# Altium project B302.PrjPcb (part 1 of 2)
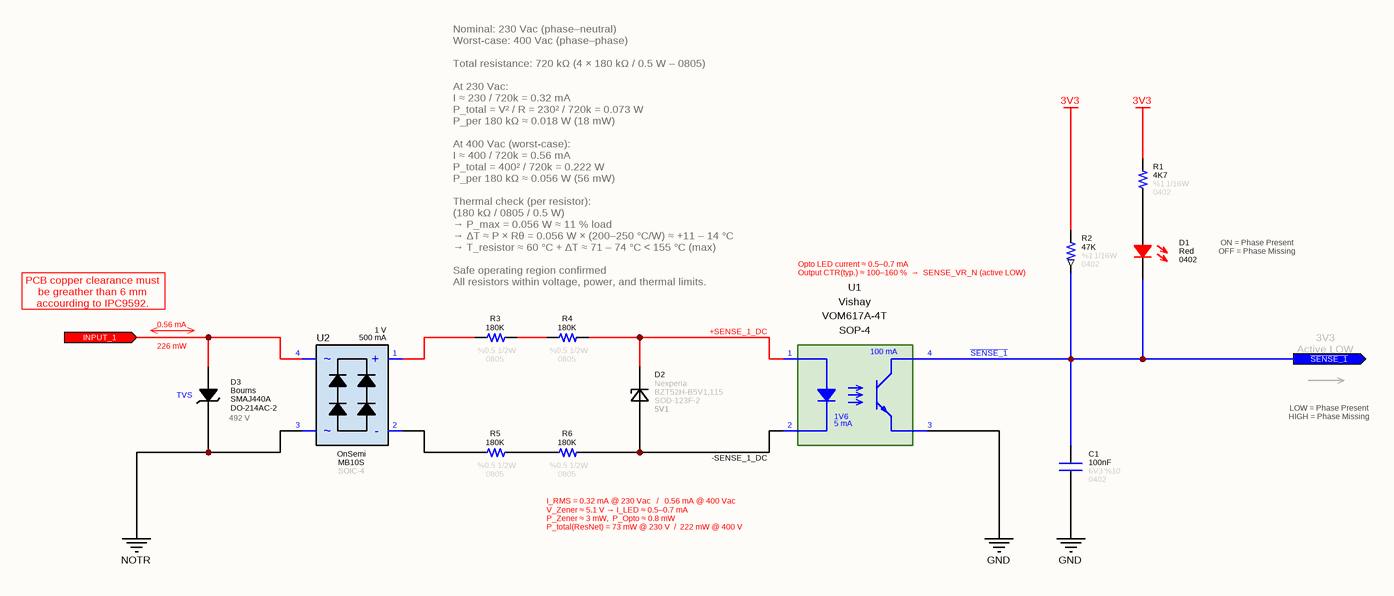
[diagram p0: Sense 1 Signal Isolation.SchDoc]
Address1_: Seker Mah. Ayyildiz Sok.; Address2_: Silverstar Apt. 7/7; Address3_: Selcuklu / Konya; Address4_: Türkiye; Copyright_: Copyright 2026 Gunce Akkoyun (Commercial Secret); Customer_: -; Engineer_: Gunce Akkoyun; Git_Repo_Address_: www.github.com/akkoyun/B302; Module_ID_: B302; Organization_: -; Product_Desc_: 220V to TTL Input Module; Product_ID_: B302; Revision_: DA; Version_: 00.00.01
11 sheets, 98 parts. Net scope: hierarchical (ports join the sheet entries above them; power ports are global).
Board file: B302.PcbDoc
Sheets:
  Sense 1 Signal Isolation.SchDoc
  Block Diagram.SchDoc
    Card Edge Connector = Card Edge Connector.SchDoc
  Sense 2 Signal Isolation.SchDoc
  Sense 3 Signal Isolation.SchDoc
  Sense 4 Signal Isolation.SchDoc
  Sense 5 Signal Isolation.SchDoc
  Sense 6 Signal Isolation.SchDoc
  Sense 7 Signal Isolation.SchDoc
  Sense 8 Signal Isolation.SchDoc
  Input Connector.SchDoc

## Sheet Sense 1 Signal Isolation.SchDoc: Signal 1 Isolator
size 292 x 193 mm; SheetNumber: 3; SheetTotal: 11

### Parts
C1  value 100nF  Tolerance: %10  Voltage: 6V3  Case: 0402  [CAPACITOR_0402]  (hidden comment: Capacitor - 100nF [0402] (MLCC))
D1  Case: 0402  Color: Red  [LED_0402]  (hidden comment: SMD LED (Red))
D2  Zener Voltage: 5V1  Manufacturer Name: Nexperia  [SOD-123F-2]  (hidden comment: BZT52H-B5V1,115)
D3  BreakDown Voltage: 492 V  Manufacturer Name: Bourns  Case: DO-214AC-2  [DO-220AA-2]  (hidden comment: SMAJ440A)
R1  value 4K7  Tolerance: %1  Case: 0402  Power: 1/16W  [RESISTOR_0402]  (hidden comment: 4K7 - 0402 - %1 - 1/16W)
R2  value 47K  Tolerance: %1  Case: 0402  Power: 1/16W  [RESISTOR_0402]  (hidden comment: 47K - 0402 - %1 - 1/16W)
R3  value 180K  Tolerance: %0.5  Case: 0805  Power: 1/2W  [RESISTOR_0805]  (hidden comment: 180K - 0805 - %0.5 - 1/2W)
R4  value 180K  Tolerance: %0.5  Case: 0805  Power: 1/2W  [RESISTOR_0805]  (hidden comment: 180K - 0805 - %0.5 - 1/2W)
R5  value 180K  Tolerance: %0.5  Case: 0805  Power: 1/2W  [RESISTOR_0805]  (hidden comment: 180K - 0805 - %0.5 - 1/2W)
R6  value 180K  Tolerance: %0.5  Case: 0805  Power: 1/2W  [RESISTOR_0805]  (hidden comment: 180K - 0805 - %0.5 - 1/2W)
U1  Manufacturer Name: Vishay  Case: SOP-4  If - Forward Current: 5 mA  Vf - Forward Voltage: 1V6  Maximum Collector Current: 100 mA  [SOP-4V2]  (hidden comment: VOM617A-4T)
U2  If - Forward Current: 500 mA  Vf - Forward Voltage: 1 V  Manufacturer Name: OnSemi  Manufacturer Part Number: MB10S  [SOIC-4]  (hidden comment: LTV-846S)

### Ports
INPUT_1 (in), ~{SENSE_1} (out)

### Nets
3V3: R1.2 R2.2
GND: C1.1 U1.3(Emiter)
NOTR: D3.2(Cathode) U2.3
+SENSE_1_DC: D2.1(Cathode) R4.1 U1.1(LED_Anode)
-SENSE_1_DC: D2.2(Anode) R6.1 U1.2(LED_Cathode)
~{SENSE_1}: C1.2 D1.1 R2.1 U1.4(Collector) ; port ~{SENSE_1}
NetD1_2: D1.2 R1.1
NetD3_1: D3.1(Anode) U2.4 ; port INPUT_1
NetR3_1: R3.1 R4.2
NetR3_2: R3.2 U2.1(+)
NetR5_1: R5.1 R6.2
NetR5_2: R5.2 U2.2(-)

### Notes on the sheet
- (near R2) Opto LED current ≈ 0.5–0.7 mA
  Output CTR(typ.) ≈ 100–160 %  →  SENSE_VR_N (active LOW)
- ON = Phase Present
  OFF = Phase Missing
- PCB copper clearance must be greather than 6 mm accourding to IPC9592.
- 0.56 mA
- (near D3) 226 mW
- Nominal: 230 Vac (phase–neutral)
  Worst-case: 400 Vac (phase–phase)
  Total resistance: 720 kΩ (4 × 180 kΩ / 0.5 W – 0805)
  At 230 Vac:
  I ≈ 230 / 720k = 0.32 mA
  P_total = V² / R = 230² / 720k = 0.073 W
  P_per 180 kΩ ≈ 0.018 W (18 mW)
  At 400 Vac (worst-case):
  I ≈ 400 / 720k = 0.56 mA
  P_total = 400² / 720k = 0.222 W
  P_per 180 kΩ ≈ 0.056 W (56 mW)
  Thermal check (per resistor):
  (180 kΩ / 0805 / 0.5 W)
  → P_max = 0.056 W ≈ 11 % load
  → ΔT ≈ P × Rθ = 0.056 W × (200–250 °C/W) ≈ +11 – 14 °C
  → T_resistor ≈ 60 °C + ΔT ≈ 71 – 74 °C < 155 °C (max)
  Safe operating region confirmed
  All resistors within voltage, power, and thermal limits.
- 3V3
  Active LOW
- LOW = Phase Present
  HIGH = Phase Missing
- I_RMS = 0.32 mA @ 230 Vac   /   0.56 mA @ 400 Vac
  V_Zener ≈ 5.1 V → I_LED ≈ 0.5–0.7 mA
  P_Zener ≈ 3 mW,  P_Opto ≈ 0.8 mW
  P_total(ResNet) = 73 mW @ 230 V  /  222 mW @ 400 V
- © 2021 All rights reserved.
  This document may not, in whole or in part, be copied, photocopied, reproduced, translated or converted to any electronic or machine readable from without prior written permission of Mehmet Günce Akkoyun.
  Engineer contact : akkoyun@me.com
- Property of
- Engineer :
- Date :
- Size :
- A4
- Time :
- Project :
- Page :
- /
- Customer :
- Product ID :
- Module ID :
- Version :
- File :
- Revision :
- (in symbol Diode - SMAJ440A (TVS)) TVS

### Library data of the parts
C1 = Capacitor - 100nF [0402-6V3]: Capacitor (MLCC) - 100nF / 6V3 / 0402; Manufacturer Name: KYOCERA AVX; Manufacturer Part Number: 04026D104KAT4A; ComponentLink1Description: Mouser; ComponentLink1URL: https://www.mouser.com.tr/ProductDetail/AVX/04026D104KAT4A?qs=sGAEpiMZZMs0AnBnWHyRQPg4iYkCw7IMED%2F4kpqgf7w%3D; ComponentLink2Description: DataSheet; ComponentLink2URL: https://www.mouser.com.tr/datasheet/2/40/cx5r-776519.pdf; Subcategory: Capacitors
D1 = Diode - LED (0402-Red): Standard LEDs - SMD MINI-MOLD ULTRA COMPACT RED; Manufacturer Name: ROHM Semiconductor; Manufacturer Part Number: SML-P12VTT86R; ROHS: Yes; ComponentLink1Description: DataSheet; ComponentLink1URL: https://www.mouser.com.tr/datasheet/2/348/sml-p1-e-1139198.pdf; ComponentLink2Description: Mouser; ComponentLink2URL: https://www.mouser.com.tr/ProductDetail/ROHM-Semiconductor/SML-P12U2TT86R?qs=sGAEpiMZZMseGfSY3csMkRIBDsfU3UCXJTULB5gem9Ta%252Bp%252BvZ709fg%3D%3D
D2 = Diode - BZT52H-B5V1,115: Zener Diodes BZT52H-B5V1/SOD123F/SOD2; Product Type: Zener Diodes; RoHS: Yes; Manufacturer Part Number: BZT52H-B5V1,115; Case: SOD-123F-2
D3 = Diode - SMAJ440A (TVS): ESD Protection Diodes / TVS Diodes 440volts 1uA .6 Amps Uni-Dir; Peak Pulse Current: 600 mA; Working Voltage: 440 V; Clamping Voltage: 713 V; Product Type: TVS Diodes; RoHS: Yes; Manufacturer Part Number: SMAJ440A
R1 = Resistor - 4K7 [0402]: Thick Film Resistors - SMD 1/16 W 4.7 KOhm 1%; Manufacturer Name: Vishay; Manufacturer Part Number: CRCW04024K70FKED; ComponentLink1Description: DataSheet; ComponentLink1URL: https://www.mouser.com.tr/datasheet/2/427/dcrcwe3-1762152.pdf; ComponentLink2Description: Mouser; ComponentLink2URL: https://www.mouser.com.tr/ProductDetail/Vishay-Dale/CRCW04024K70FKED?qs=sGAEpiMZZMu61qfTUdNhG7nHf%2F6MTUn3HadIdDQu24Q%3D
R2 = Resistor - 47K [0402]: Thick Film Resistors - SMD 1/16 W 47 KOhm 1%; Manufacturer Name: Vishay; Manufacturer Part Number: CRCW040247K0FKED; ComponentLink1Description: DataSheet; ComponentLink1URL: https://www.mouser.com.tr/datasheet/2/427/dcrcwe3-1762152.pdf; ComponentLink2Description: Mouser; ComponentLink2URL: https://www.mouser.com.tr/ProductDetail/Vishay-Dale/CRCW040247K0FKED?qs=sGAEpiMZZMu61qfTUdNhG2DpbjADlD3GL%252B3h1elTxqU%3D
R3-R6 = Resistor - 180K [0805]: Thick Film Resistors - SMD 0805 180Kohms 0.5W 0.5% AEC-Q200; Manufacturer Name: Panasonic; Manufacturer Part Number: ERJ-P06D1803V; ComponentLink1Description: DataSheet; ComponentLink1URL: https://www.mouser.com.tr/datasheet/2/427/dcrcwe3-1762152.pdf; ComponentLink2Description: Mouser; ComponentLink2URL: https://www.mouser.com.tr/ProductDetail/Vishay-Dale/CRCW040210K0FKED?qs=sGAEpiMZZMu61qfTUdNhG2DpbjADlD3GcalbOv9utCY%3D
U1 = IC - VOM617A: Transistor Output Optocouplers Phototransistor Out CTR 160-320% 5mA; RoHS: Yes; Product Type: Transistor Output Optocouplers; Manufacturer Part Number: VOM617A-4T
U2 = IC - MB10S: Transistor Output Optocouplers Optocplr Phototrans 4-Channel; Case: SOIC-4

## Sheet Block Diagram.SchDoc: B302AA Block Diagram
size 292 x 193 mm; SheetNumber: 1; SheetTotal: 11
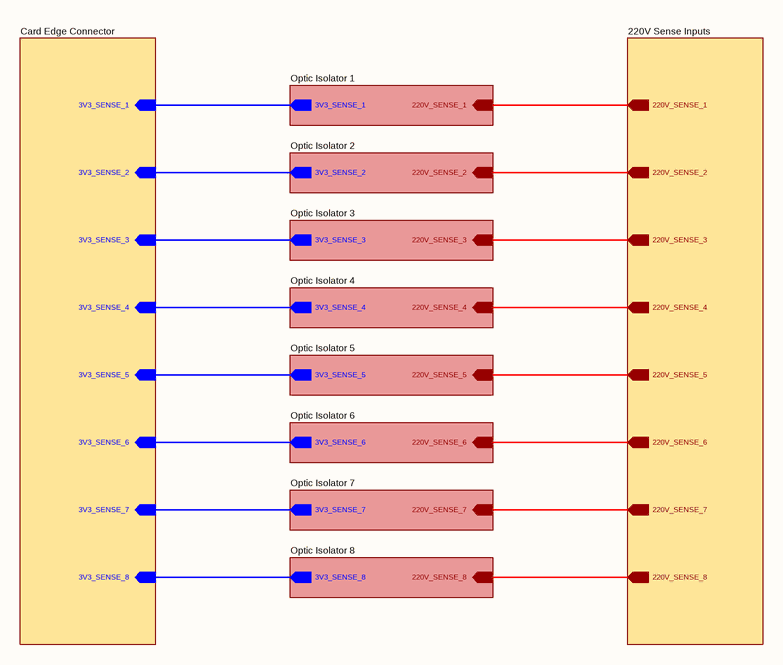
[diagram p1: Block Diagram.SchDoc]

### Sub-sheets
220V Sense Inputs = 220V Sense Input Socket.SchDoc (file not in this document): 220V_SENSE_2 (out), 220V_SENSE_1 (out), 220V_SENSE_5 (out), 220V_SENSE_6 (out), 220V_SENSE_3 (out), 220V_SENSE_4 (out), 220V_SENSE_7 (out), 220V_SENSE_8 (out)
Card Edge Connector = Card Edge Connector.SchDoc: 3V3_SENSE_1 (in), 3V3_SENSE_2 (in), 3V3_SENSE_3 (in), 3V3_SENSE_4 (in), 3V3_SENSE_5 (in), 3V3_SENSE_6 (in), 3V3_SENSE_8 (in), 3V3_SENSE_7 (in)
Optic Isolator 1 = Opto Isolator 1.SchDoc (file not in this document): 220V_SENSE_1 (in), 3V3_SENSE_1 (out)
Optic Isolator 2 = Opto Isolator 2.SchDoc (file not in this document): 220V_SENSE_2 (in), 3V3_SENSE_2 (out)
Optic Isolator 3 = Opto Isolator 3.SchDoc (file not in this document): 220V_SENSE_3 (in), 3V3_SENSE_3 (out)
Optic Isolator 4 = Opto Isolator 4.SchDoc (file not in this document): 220V_SENSE_4 (in), 3V3_SENSE_4 (out)
Optic Isolator 5 = Opto Isolator 5.SchDoc (file not in this document): 220V_SENSE_5 (in), 3V3_SENSE_5 (out)
Optic Isolator 6 = Opto Isolator 6.SchDoc (file not in this document): 220V_SENSE_6 (in), 3V3_SENSE_6 (out)
Optic Isolator 7 = Opto Isolator 7.SchDoc (file not in this document): 220V_SENSE_7 (in), 3V3_SENSE_7 (out)
Optic Isolator 8 = Opto Isolator 8.SchDoc (file not in this document): 220V_SENSE_8 (in), 3V3_SENSE_8 (out)

### Nets
(unnamed): sheet 220V Sense Inputs/220V_SENSE_2, sheet Optic Isolator 2/220V_SENSE_2
(unnamed): sheet 220V Sense Inputs/220V_SENSE_1, sheet Optic Isolator 1/220V_SENSE_1
(unnamed): sheet 220V Sense Inputs/220V_SENSE_5, sheet Optic Isolator 5/220V_SENSE_5
(unnamed): sheet 220V Sense Inputs/220V_SENSE_6, sheet Optic Isolator 6/220V_SENSE_6
(unnamed): sheet 220V Sense Inputs/220V_SENSE_3, sheet Optic Isolator 3/220V_SENSE_3
(unnamed): sheet 220V Sense Inputs/220V_SENSE_4, sheet Optic Isolator 4/220V_SENSE_4
(unnamed): sheet 220V Sense Inputs/220V_SENSE_7, sheet Optic Isolator 7/220V_SENSE_7
(unnamed): sheet 220V Sense Inputs/220V_SENSE_8, sheet Optic Isolator 8/220V_SENSE_8
(unnamed): sheet Optic Isolator 1/3V3_SENSE_1, sheet Card Edge Connector/3V3_SENSE_1
(unnamed): sheet Card Edge Connector/3V3_SENSE_2, sheet Optic Isolator 2/3V3_SENSE_2
(unnamed): sheet Card Edge Connector/3V3_SENSE_3, sheet Optic Isolator 3/3V3_SENSE_3
(unnamed): sheet Card Edge Connector/3V3_SENSE_4, sheet Optic Isolator 4/3V3_SENSE_4
(unnamed): sheet Card Edge Connector/3V3_SENSE_5, sheet Optic Isolator 5/3V3_SENSE_5
(unnamed): sheet Card Edge Connector/3V3_SENSE_6, sheet Optic Isolator 6/3V3_SENSE_6
(unnamed): sheet Card Edge Connector/3V3_SENSE_8, sheet Optic Isolator 8/3V3_SENSE_8
(unnamed): sheet Card Edge Connector/3V3_SENSE_7, sheet Optic Isolator 7/3V3_SENSE_7

### Notes on the sheet
- © 2021 All rights reserved.
  This document may not, in whole or in part, be copied, photocopied, reproduced, translated or converted to any electronic or machine readable from without prior written permission of Mehmet Günce Akkoyun.
  Engineer contact : akkoyun@me.com
- Property of
- Engineer :
- Date :
- Size :
- A4
- Time :
- Project :
- Page :
- /
- Customer :
- Product ID :
- Module ID :
- Version :
- File :
- Revision :

## Sheet Card Edge Connector.SchDoc: Card Edge Connector
size 292 x 193 mm; SheetNumber: 2; SheetTotal: 11
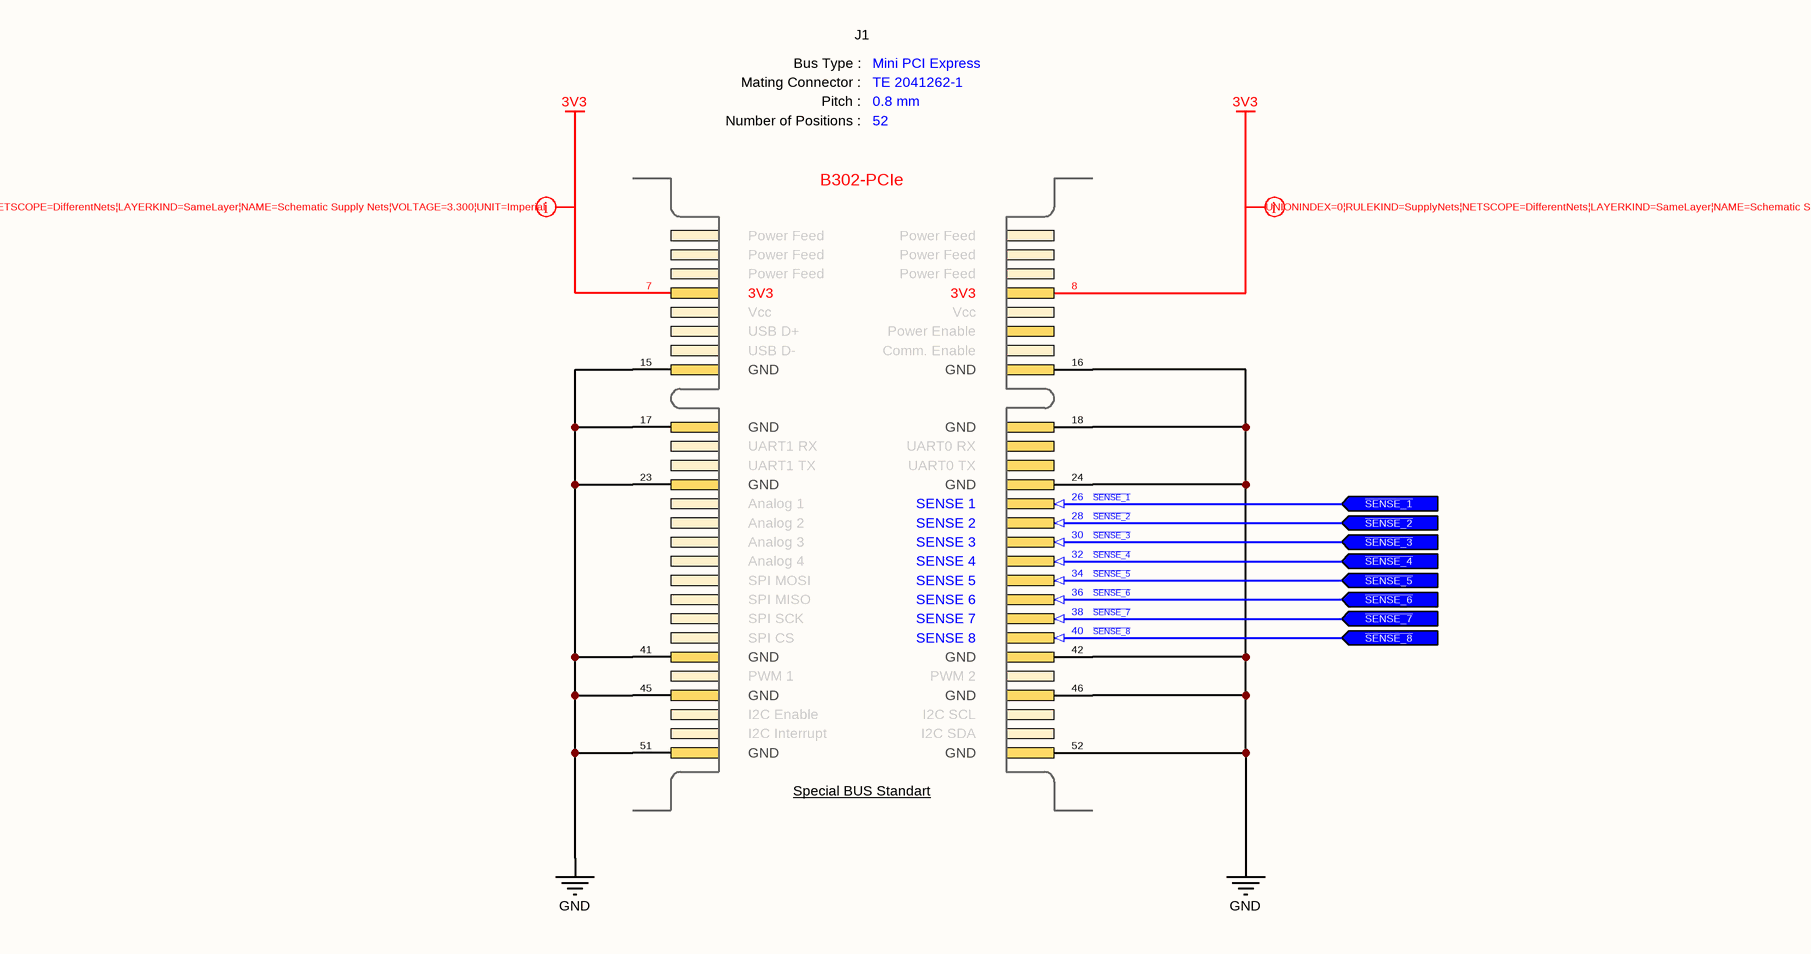
[diagram p2: Card Edge Connector.SchDoc]

### Parts
J1  BUS Type: Mini PCI Express  Mating Connector: TE 2041262-1  Pitch: 0.8 mm  Number of Positions: 52  [PCB - Mini PCI Express]  (hidden comment: Connector - Mini PCI-E (Male B302-PCIe))  (no BOM)

### Ports
~{SENSE_1} (in), ~{SENSE_2} (in), ~{SENSE_3} (in), ~{SENSE_4} (in), ~{SENSE_5} (in), ~{SENSE_6} (in), ~{SENSE_7} (in), ~{SENSE_8} (in)

### Nets
3V3: J1.7(Pin-7) J1.8(Pin-8)
GND: J1.15(Pin-15) J1.16(Pin-16) J1.17(Pin-17) J1.18(Pin-18) J1.23(Pin-23) J1.24(Pin-24) J1.41(Pin-41) J1.42(Pin-42) J1.45(Pin-45) J1.46(Pin-46) J1.51(Pin-51) J1.52(Pin-52)
~{SENSE_1}: J1.26(Pin-26) ; port ~{SENSE_1}
~{SENSE_2}: J1.28(Pin-28) ; port ~{SENSE_2}
~{SENSE_3}: J1.30(Pin-30) ; port ~{SENSE_3}
~{SENSE_4}: J1.32(Pin-32) ; port ~{SENSE_4}
~{SENSE_5}: J1.34(Pin-34) ; port ~{SENSE_5}
~{SENSE_6}: J1.36(Pin-36) ; port ~{SENSE_6}
~{SENSE_7}: J1.38(Pin-38) ; port ~{SENSE_7}
~{SENSE_8}: J1.40(Pin-40) ; port ~{SENSE_8}

### Layout directives
rule Supply Nets [Voltage = 3.300]: 3V3

### Notes on the sheet
- © 2021 All rights reserved.
  This document may not, in whole or in part, be copied, photocopied, reproduced, translated or converted to any electronic or machine readable from without prior written permission of Mehmet Günce Akkoyun.
  Engineer contact : akkoyun@me.com
- Property of
- Engineer :
- Date :
- Size :
- A4
- Time :
- Project :
- Page :
- /
- Customer :
- Product ID :
- Module ID :
- Version :
- File :
- Revision :
- (in symbol Connector - Mini PCI-E (Male B302-PCIe)) Bus Type :; Mating Connector :; Pitch :; Number of Positions :; B302-PCIe; Power Feed; 3V3; Vcc; USB D+; Power Enable; USB D-; Comm. Enable; GND; UART1 RX; UART0 RX; UART1 TX; UART0 TX; Analog 1; SENSE 1; Analog 2; SENSE 2; Analog 3; SENSE 3; Analog 4; SENSE 4; SPI MOSI; SENSE 5; SPI MISO; SENSE 6; SPI SCK; SENSE 7; SPI CS; SENSE 8; PWM 1; PWM 2; I2C Enable; I2C SCL; I2C Interrupt; I2C SDA; Special BUS Standart

### Library data of the parts
J1 = Connector - Mini PCI-E (Male B302-PCIe): Mini PCI-Express gold finger connector.; System: Connector

## Sheet Sense 2 Signal Isolation.SchDoc: Signal 2 Isolator
size 292 x 193 mm; SheetNumber: 4; SheetTotal: 11
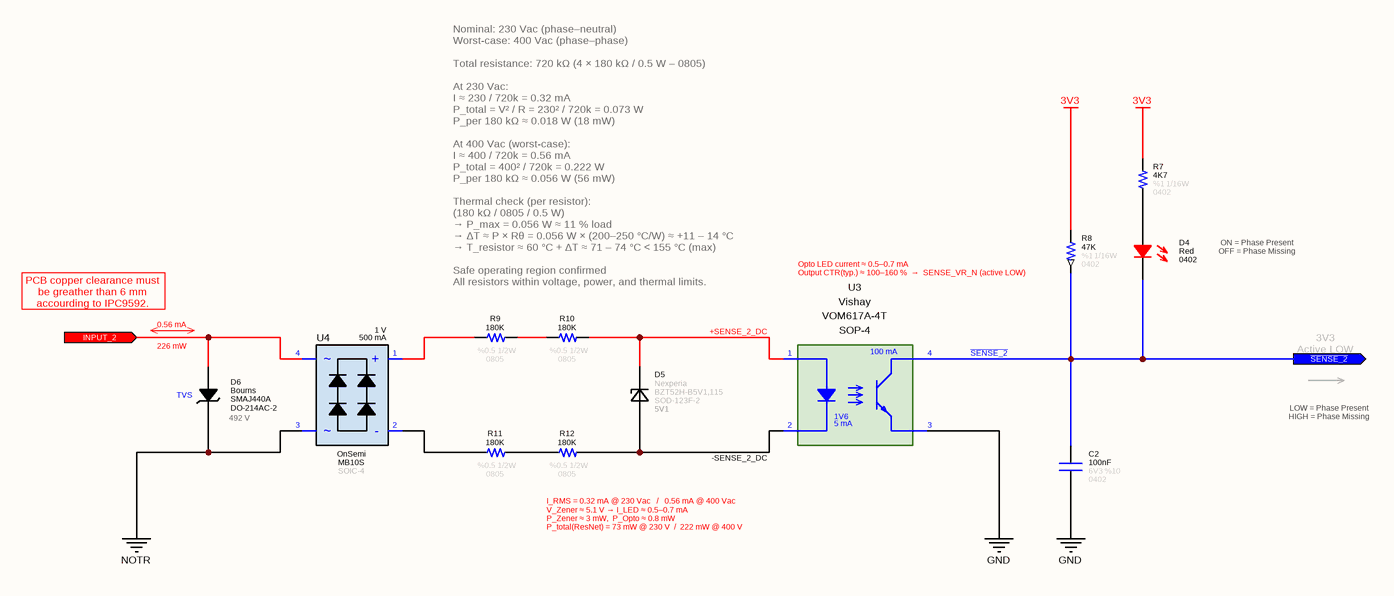
[diagram p3: Sense 2 Signal Isolation.SchDoc]

### Parts
C2  value 100nF  Tolerance: %10  Voltage: 6V3  Case: 0402  [CAPACITOR_0402]  (hidden comment: Capacitor - 100nF [0402] (MLCC))
D4  Case: 0402  Color: Red  [LED_0402]  (hidden comment: SMD LED (Red))
D5  Zener Voltage: 5V1  Manufacturer Name: Nexperia  [SOD-123F-2]  (hidden comment: BZT52H-B5V1,115)
D6  BreakDown Voltage: 492 V  Manufacturer Name: Bourns  Case: DO-214AC-2  [DO-220AA-2]  (hidden comment: SMAJ440A)
R7  value 4K7  Tolerance: %1  Case: 0402  Power: 1/16W  [RESISTOR_0402]  (hidden comment: 4K7 - 0402 - %1 - 1/16W)
R8  value 47K  Tolerance: %1  Case: 0402  Power: 1/16W  [RESISTOR_0402]  (hidden comment: 47K - 0402 - %1 - 1/16W)
R9  value 180K  Tolerance: %0.5  Case: 0805  Power: 1/2W  [RESISTOR_0805]  (hidden comment: 180K - 0805 - %0.5 - 1/2W)
R10  value 180K  Tolerance: %0.5  Case: 0805  Power: 1/2W  [RESISTOR_0805]  (hidden comment: 180K - 0805 - %0.5 - 1/2W)
R11  value 180K  Tolerance: %0.5  Case: 0805  Power: 1/2W  [RESISTOR_0805]  (hidden comment: 180K - 0805 - %0.5 - 1/2W)
R12  value 180K  Tolerance: %0.5  Case: 0805  Power: 1/2W  [RESISTOR_0805]  (hidden comment: 180K - 0805 - %0.5 - 1/2W)
U3  Manufacturer Name: Vishay  Case: SOP-4  If - Forward Current: 5 mA  Vf - Forward Voltage: 1V6  Maximum Collector Current: 100 mA  [SOP-4V2]  (hidden comment: VOM617A-4T)
U4  If - Forward Current: 500 mA  Vf - Forward Voltage: 1 V  Manufacturer Name: OnSemi  Manufacturer Part Number: MB10S  [SOIC-4]  (hidden comment: LTV-846S)

### Ports
INPUT_2 (in), ~{SENSE_2} (out)

### Nets
3V3: R7.2 R8.2
GND: C2.1 U3.3(Emiter)
NOTR: D6.2(Cathode) U4.3
+SENSE_2_DC: D5.1(Cathode) R10.1 U3.1(LED_Anode)
-SENSE_2_DC: D5.2(Anode) R12.1 U3.2(LED_Cathode)
~{SENSE_2}: C2.2 D4.1 R8.1 U3.4(Collector) ; port ~{SENSE_2}
NetD4_2: D4.2 R7.1
NetD6_1: D6.1(Anode) U4.4 ; port INPUT_2
NetR9_1: R9.1 R10.2
NetR9_2: R9.2 U4.1(+)
NetR11_1: R11.1 R12.2
NetR11_2: R11.2 U4.2(-)

### Notes on the sheet
- (near R8) Opto LED current ≈ 0.5–0.7 mA
  Output CTR(typ.) ≈ 100–160 %  →  SENSE_VR_N (active LOW)
- ON = Phase Present
  OFF = Phase Missing
- PCB copper clearance must be greather than 6 mm accourding to IPC9592.
- 0.56 mA
- (near D6) 226 mW
- Nominal: 230 Vac (phase–neutral)
  Worst-case: 400 Vac (phase–phase)
  Total resistance: 720 kΩ (4 × 180 kΩ / 0.5 W – 0805)
  At 230 Vac:
  I ≈ 230 / 720k = 0.32 mA
  P_total = V² / R = 230² / 720k = 0.073 W
  P_per 180 kΩ ≈ 0.018 W (18 mW)
  At 400 Vac (worst-case):
  I ≈ 400 / 720k = 0.56 mA
  P_total = 400² / 720k = 0.222 W
  P_per 180 kΩ ≈ 0.056 W (56 mW)
  Thermal check (per resistor):
  (180 kΩ / 0805 / 0.5 W)
  → P_max = 0.056 W ≈ 11 % load
  → ΔT ≈ P × Rθ = 0.056 W × (200–250 °C/W) ≈ +11 – 14 °C
  → T_resistor ≈ 60 °C + ΔT ≈ 71 – 74 °C < 155 °C (max)
  Safe operating region confirmed
  All resistors within voltage, power, and thermal limits.
- 3V3
  Active LOW
- LOW = Phase Present
  HIGH = Phase Missing
- I_RMS = 0.32 mA @ 230 Vac   /   0.56 mA @ 400 Vac
  V_Zener ≈ 5.1 V → I_LED ≈ 0.5–0.7 mA
  P_Zener ≈ 3 mW,  P_Opto ≈ 0.8 mW
  P_total(ResNet) = 73 mW @ 230 V  /  222 mW @ 400 V
- © 2021 All rights reserved.
  This document may not, in whole or in part, be copied, photocopied, reproduced, translated or converted to any electronic or machine readable from without prior written permission of Mehmet Günce Akkoyun.
  Engineer contact : akkoyun@me.com
- Property of
- Engineer :
- Date :
- Size :
- A4
- Time :
- Project :
- Page :
- /
- Customer :
- Product ID :
- Module ID :
- Version :
- File :
- Revision :
- (in symbol Diode - SMAJ440A (TVS)) TVS

### Library data of the parts
C2 = Capacitor - 100nF [0402-6V3]: as C1 on sheet Sense 1 Signal Isolation; ComponentLink1Description: Mouser; ComponentLink1URL: https://www.mouser.com.tr/ProductDetail/AVX/04026D104KAT4A?qs=sGAEpiMZZMs0AnBnWHyRQPg4iYkCw7IMED%2F4kpqgf7w%3D; ComponentLink2Description: DataSheet; ComponentLink2URL: https://www.mouser.com.tr/datasheet/2/40/cx5r-776519.pdf; Subcategory: Capacitors
D4 = Diode - LED (0402-Red): as D1 on sheet Sense 1 Signal Isolation; ROHS: Yes; ComponentLink1Description: DataSheet; ComponentLink1URL: https://www.mouser.com.tr/datasheet/2/348/sml-p1-e-1139198.pdf; ComponentLink2Description: Mouser; ComponentLink2URL: https://www.mouser.com.tr/ProductDetail/ROHM-Semiconductor/SML-P12U2TT86R?qs=sGAEpiMZZMseGfSY3csMkRIBDsfU3UCXJTULB5gem9Ta%252Bp%252BvZ709fg%3D%3D
D5 = Diode - BZT52H-B5V1,115: Zener Diodes BZT52H-B5V1/SOD123F/SOD2; Product Type: Zener Diodes; RoHS: Yes; Manufacturer Part Number: BZT52H-B5V1,115; Case: SOD-123F-2
D6 = Diode - SMAJ440A (TVS): as D3 on sheet Sense 1 Signal Isolation; Product Type: TVS Diodes; RoHS: Yes; Manufacturer Part Number: SMAJ440A
R7 = Resistor - 4K7 [0402]: as R1 on sheet Sense 1 Signal Isolation; ComponentLink1Description: DataSheet; ComponentLink1URL: https://www.mouser.com.tr/datasheet/2/427/dcrcwe3-1762152.pdf; ComponentLink2Description: Mouser; ComponentLink2URL: https://www.mouser.com.tr/ProductDetail/Vishay-Dale/CRCW04024K70FKED?qs=sGAEpiMZZMu61qfTUdNhG7nHf%2F6MTUn3HadIdDQu24Q%3D
R8 = Resistor - 47K [0402]: as R2 on sheet Sense 1 Signal Isolation; ComponentLink1Description: DataSheet; ComponentLink1URL: https://www.mouser.com.tr/datasheet/2/427/dcrcwe3-1762152.pdf; ComponentLink2Description: Mouser; ComponentLink2URL: https://www.mouser.com.tr/ProductDetail/Vishay-Dale/CRCW040247K0FKED?qs=sGAEpiMZZMu61qfTUdNhG2DpbjADlD3GL%252B3h1elTxqU%3D
R9-R12 = Resistor - 180K [0805]: as R3 on sheet Sense 1 Signal Isolation; ComponentLink1Description: DataSheet; ComponentLink1URL: https://www.mouser.com.tr/datasheet/2/427/dcrcwe3-1762152.pdf; ComponentLink2Description: Mouser; ComponentLink2URL: https://www.mouser.com.tr/ProductDetail/Vishay-Dale/CRCW040210K0FKED?qs=sGAEpiMZZMu61qfTUdNhG2DpbjADlD3GcalbOv9utCY%3D
U3 = IC - VOM617A: as U1 on sheet Sense 1 Signal Isolation; RoHS: Yes; Product Type: Transistor Output Optocouplers; Manufacturer Part Number: VOM617A-4T
U4 = IC - MB10S: as U2 on sheet Sense 1 Signal Isolation; Case: SOIC-4

## Sheet Sense 3 Signal Isolation.SchDoc: Signal 3 Isolator
size 292 x 193 mm; SheetNumber: 5; SheetTotal: 11
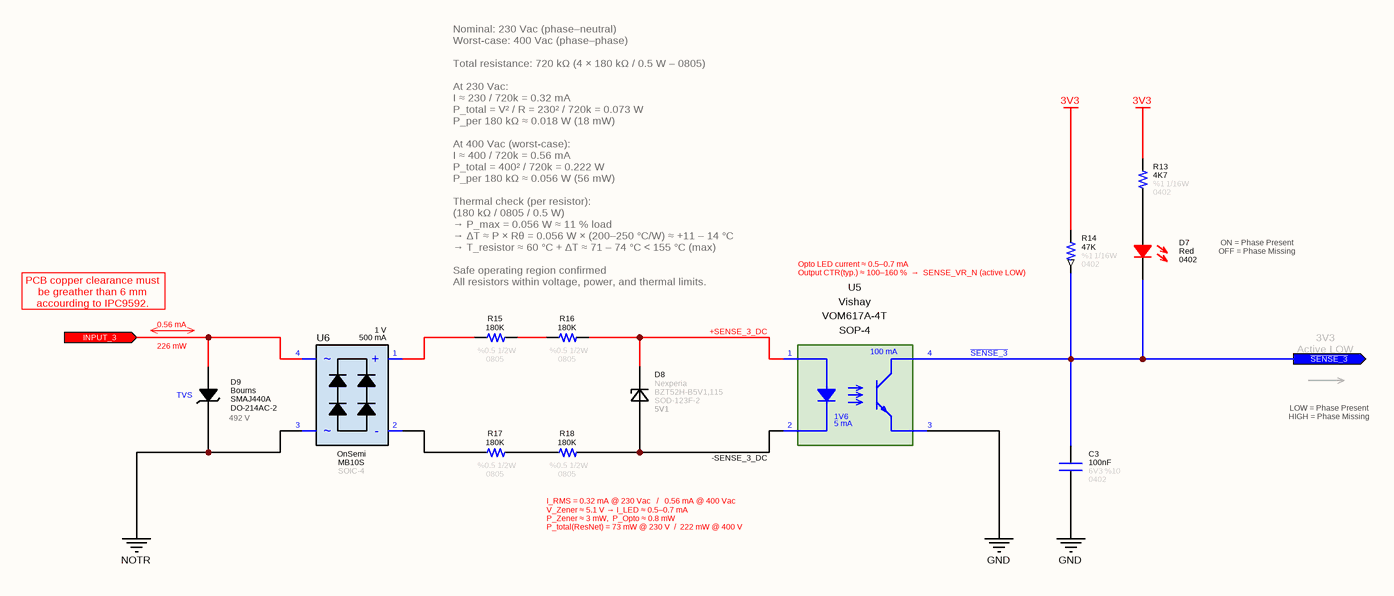
[diagram p4: Sense 3 Signal Isolation.SchDoc]

### Parts
C3  value 100nF  Tolerance: %10  Voltage: 6V3  Case: 0402  [CAPACITOR_0402]  (hidden comment: Capacitor - 100nF [0402] (MLCC))
D7  Case: 0402  Color: Red  [LED_0402]  (hidden comment: SMD LED (Red))
D8  Zener Voltage: 5V1  Manufacturer Name: Nexperia  [SOD-123F-2]  (hidden comment: BZT52H-B5V1,115)
D9  BreakDown Voltage: 492 V  Manufacturer Name: Bourns  Case: DO-214AC-2  [DO-220AA-2]  (hidden comment: SMAJ440A)
R13  value 4K7  Tolerance: %1  Case: 0402  Power: 1/16W  [RESISTOR_0402]  (hidden comment: 4K7 - 0402 - %1 - 1/16W)
R14  value 47K  Tolerance: %1  Case: 0402  Power: 1/16W  [RESISTOR_0402]  (hidden comment: 47K - 0402 - %1 - 1/16W)
R15  value 180K  Tolerance: %0.5  Case: 0805  Power: 1/2W  [RESISTOR_0805]  (hidden comment: 180K - 0805 - %0.5 - 1/2W)
R16  value 180K  Tolerance: %0.5  Case: 0805  Power: 1/2W  [RESISTOR_0805]  (hidden comment: 180K - 0805 - %0.5 - 1/2W)
R17  value 180K  Tolerance: %0.5  Case: 0805  Power: 1/2W  [RESISTOR_0805]  (hidden comment: 180K - 0805 - %0.5 - 1/2W)
R18  value 180K  Tolerance: %0.5  Case: 0805  Power: 1/2W  [RESISTOR_0805]  (hidden comment: 180K - 0805 - %0.5 - 1/2W)
U5  Manufacturer Name: Vishay  Case: SOP-4  If - Forward Current: 5 mA  Vf - Forward Voltage: 1V6  Maximum Collector Current: 100 mA  [SOP-4V2]  (hidden comment: VOM617A-4T)
U6  If - Forward Current: 500 mA  Vf - Forward Voltage: 1 V  Manufacturer Name: OnSemi  Manufacturer Part Number: MB10S  [SOIC-4]  (hidden comment: LTV-846S)

### Ports
INPUT_3 (in), ~{SENSE_3} (out)

### Nets
3V3: R13.2 R14.2
GND: C3.1 U5.3(Emiter)
NOTR: D9.2(Cathode) U6.3
+SENSE_3_DC: D8.1(Cathode) R16.1 U5.1(LED_Anode)
-SENSE_3_DC: D8.2(Anode) R18.1 U5.2(LED_Cathode)
~{SENSE_3}: C3.2 D7.1 R14.1 U5.4(Collector) ; port ~{SENSE_3}
NetD7_2: D7.2 R13.1
NetD9_1: D9.1(Anode) U6.4 ; port INPUT_3
NetR15_1: R15.1 R16.2
NetR15_2: R15.2 U6.1(+)
NetR17_1: R17.1 R18.2
NetR17_2: R17.2 U6.2(-)

### Notes on the sheet
- (near R14) Opto LED current ≈ 0.5–0.7 mA
  Output CTR(typ.) ≈ 100–160 %  →  SENSE_VR_N (active LOW)
- ON = Phase Present
  OFF = Phase Missing
- PCB copper clearance must be greather than 6 mm accourding to IPC9592.
- 0.56 mA
- (near D9) 226 mW
- Nominal: 230 Vac (phase–neutral)
  Worst-case: 400 Vac (phase–phase)
  Total resistance: 720 kΩ (4 × 180 kΩ / 0.5 W – 0805)
  At 230 Vac:
  I ≈ 230 / 720k = 0.32 mA
  P_total = V² / R = 230² / 720k = 0.073 W
  P_per 180 kΩ ≈ 0.018 W (18 mW)
  At 400 Vac (worst-case):
  I ≈ 400 / 720k = 0.56 mA
  P_total = 400² / 720k = 0.222 W
  P_per 180 kΩ ≈ 0.056 W (56 mW)
  Thermal check (per resistor):
  (180 kΩ / 0805 / 0.5 W)
  → P_max = 0.056 W ≈ 11 % load
  → ΔT ≈ P × Rθ = 0.056 W × (200–250 °C/W) ≈ +11 – 14 °C
  → T_resistor ≈ 60 °C + ΔT ≈ 71 – 74 °C < 155 °C (max)
  Safe operating region confirmed
  All resistors within voltage, power, and thermal limits.
- 3V3
  Active LOW
- LOW = Phase Present
  HIGH = Phase Missing
- I_RMS = 0.32 mA @ 230 Vac   /   0.56 mA @ 400 Vac
  V_Zener ≈ 5.1 V → I_LED ≈ 0.5–0.7 mA
  P_Zener ≈ 3 mW,  P_Opto ≈ 0.8 mW
  P_total(ResNet) = 73 mW @ 230 V  /  222 mW @ 400 V
- © 2021 All rights reserved.
  This document may not, in whole or in part, be copied, photocopied, reproduced, translated or converted to any electronic or machine readable from without prior written permission of Mehmet Günce Akkoyun.
  Engineer contact : akkoyun@me.com
- Property of
- Engineer :
- Date :
- Size :
- A4
- Time :
- Project :
- Page :
- /
- Customer :
- Product ID :
- Module ID :
- Version :
- File :
- Revision :
- (in symbol Diode - SMAJ440A (TVS)) TVS

### Library data of the parts
C3 = Capacitor - 100nF [0402-6V3]: as C1 on sheet Sense 1 Signal Isolation; ComponentLink1Description: Mouser; ComponentLink1URL: https://www.mouser.com.tr/ProductDetail/AVX/04026D104KAT4A?qs=sGAEpiMZZMs0AnBnWHyRQPg4iYkCw7IMED%2F4kpqgf7w%3D; ComponentLink2Description: DataSheet; ComponentLink2URL: https://www.mouser.com.tr/datasheet/2/40/cx5r-776519.pdf; Subcategory: Capacitors
D7 = Diode - LED (0402-Red): as D1 on sheet Sense 1 Signal Isolation; ROHS: Yes; ComponentLink1Description: DataSheet; ComponentLink1URL: https://www.mouser.com.tr/datasheet/2/348/sml-p1-e-1139198.pdf; ComponentLink2Description: Mouser; ComponentLink2URL: https://www.mouser.com.tr/ProductDetail/ROHM-Semiconductor/SML-P12U2TT86R?qs=sGAEpiMZZMseGfSY3csMkRIBDsfU3UCXJTULB5gem9Ta%252Bp%252BvZ709fg%3D%3D
D8 = Diode - BZT52H-B5V1,115: Zener Diodes BZT52H-B5V1/SOD123F/SOD2; Product Type: Zener Diodes; RoHS: Yes; Manufacturer Part Number: BZT52H-B5V1,115; Case: SOD-123F-2
D9 = Diode - SMAJ440A (TVS): as D3 on sheet Sense 1 Signal Isolation; Product Type: TVS Diodes; RoHS: Yes; Manufacturer Part Number: SMAJ440A
R13 = Resistor - 4K7 [0402]: as R1 on sheet Sense 1 Signal Isolation; ComponentLink1Description: DataSheet; ComponentLink1URL: https://www.mouser.com.tr/datasheet/2/427/dcrcwe3-1762152.pdf; ComponentLink2Description: Mouser; ComponentLink2URL: https://www.mouser.com.tr/ProductDetail/Vishay-Dale/CRCW04024K70FKED?qs=sGAEpiMZZMu61qfTUdNhG7nHf%2F6MTUn3HadIdDQu24Q%3D
R14 = Resistor - 47K [0402]: as R2 on sheet Sense 1 Signal Isolation; ComponentLink1Description: DataSheet; ComponentLink1URL: https://www.mouser.com.tr/datasheet/2/427/dcrcwe3-1762152.pdf; ComponentLink2Description: Mouser; ComponentLink2URL: https://www.mouser.com.tr/ProductDetail/Vishay-Dale/CRCW040247K0FKED?qs=sGAEpiMZZMu61qfTUdNhG2DpbjADlD3GL%252B3h1elTxqU%3D
R15-R18 = Resistor - 180K [0805]: as R3 on sheet Sense 1 Signal Isolation; ComponentLink1Description: DataSheet; ComponentLink1URL: https://www.mouser.com.tr/datasheet/2/427/dcrcwe3-1762152.pdf; ComponentLink2Description: Mouser; ComponentLink2URL: https://www.mouser.com.tr/ProductDetail/Vishay-Dale/CRCW040210K0FKED?qs=sGAEpiMZZMu61qfTUdNhG2DpbjADlD3GcalbOv9utCY%3D
U5 = IC - VOM617A: as U1 on sheet Sense 1 Signal Isolation; RoHS: Yes; Product Type: Transistor Output Optocouplers; Manufacturer Part Number: VOM617A-4T
U6 = IC - MB10S: as U2 on sheet Sense 1 Signal Isolation; Case: SOIC-4

## Sheet Sense 4 Signal Isolation.SchDoc: Signal 4 Isolator
size 292 x 193 mm; SheetNumber: 6; SheetTotal: 11
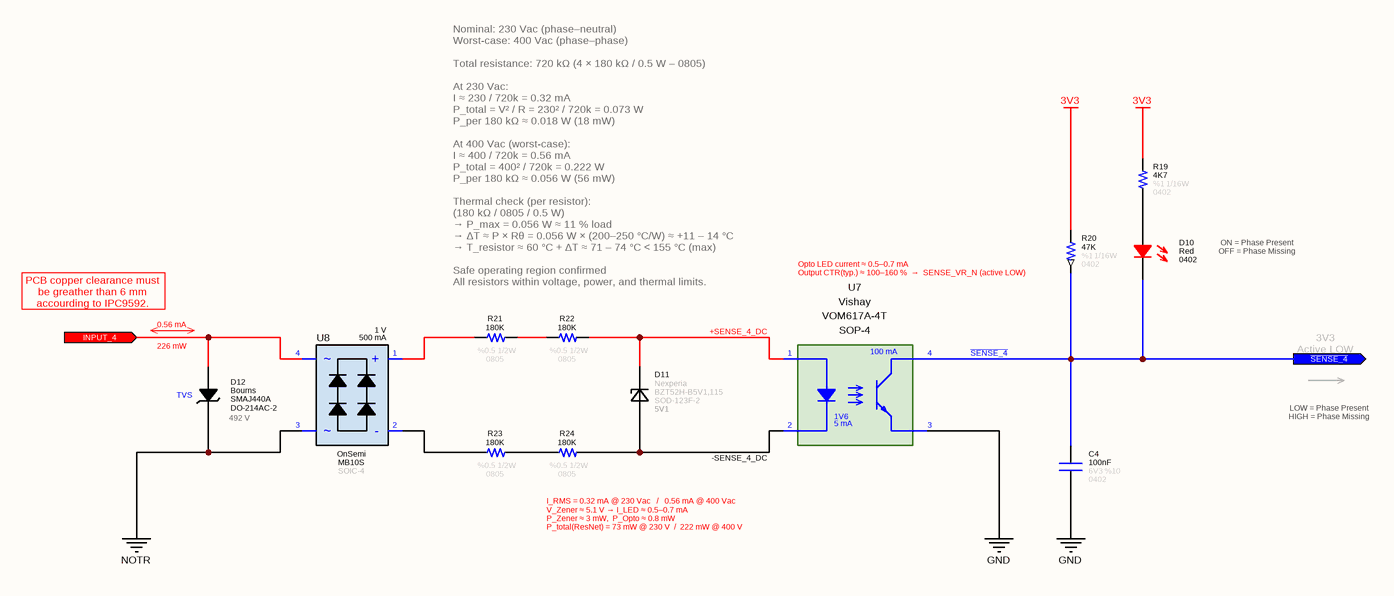
[diagram p5: Sense 4 Signal Isolation.SchDoc]

### Parts
C4  value 100nF  Tolerance: %10  Voltage: 6V3  Case: 0402  [CAPACITOR_0402]  (hidden comment: Capacitor - 100nF [0402] (MLCC))
D10  Case: 0402  Color: Red  [LED_0402]  (hidden comment: SMD LED (Red))
D11  Zener Voltage: 5V1  Manufacturer Name: Nexperia  [SOD-123F-2]  (hidden comment: BZT52H-B5V1,115)
D12  BreakDown Voltage: 492 V  Manufacturer Name: Bourns  Case: DO-214AC-2  [DO-220AA-2]  (hidden comment: SMAJ440A)
R19  value 4K7  Tolerance: %1  Case: 0402  Power: 1/16W  [RESISTOR_0402]  (hidden comment: 4K7 - 0402 - %1 - 1/16W)
R20  value 47K  Tolerance: %1  Case: 0402  Power: 1/16W  [RESISTOR_0402]  (hidden comment: 47K - 0402 - %1 - 1/16W)
R21  value 180K  Tolerance: %0.5  Case: 0805  Power: 1/2W  [RESISTOR_0805]  (hidden comment: 180K - 0805 - %0.5 - 1/2W)
R22  value 180K  Tolerance: %0.5  Case: 0805  Power: 1/2W  [RESISTOR_0805]  (hidden comment: 180K - 0805 - %0.5 - 1/2W)
R23  value 180K  Tolerance: %0.5  Case: 0805  Power: 1/2W  [RESISTOR_0805]  (hidden comment: 180K - 0805 - %0.5 - 1/2W)
R24  value 180K  Tolerance: %0.5  Case: 0805  Power: 1/2W  [RESISTOR_0805]  (hidden comment: 180K - 0805 - %0.5 - 1/2W)
U7  Manufacturer Name: Vishay  Case: SOP-4  If - Forward Current: 5 mA  Vf - Forward Voltage: 1V6  Maximum Collector Current: 100 mA  [SOP-4V2]  (hidden comment: VOM617A-4T)
U8  If - Forward Current: 500 mA  Vf - Forward Voltage: 1 V  Manufacturer Name: OnSemi  Manufacturer Part Number: MB10S  [SOIC-4]  (hidden comment: LTV-846S)

### Ports
INPUT_4 (in), ~{SENSE_4} (out)

### Nets
3V3: R19.2 R20.2
GND: C4.1 U7.3(Emiter)
NOTR: D12.2(Cathode) U8.3
+SENSE_4_DC: D11.1(Cathode) R22.1 U7.1(LED_Anode)
-SENSE_4_DC: D11.2(Anode) R24.1 U7.2(LED_Cathode)
~{SENSE_4}: C4.2 D10.1 R20.1 U7.4(Collector) ; port ~{SENSE_4}
NetD10_2: D10.2 R19.1
NetD12_1: D12.1(Anode) U8.4 ; port INPUT_4
NetR21_1: R21.1 R22.2
NetR21_2: R21.2 U8.1(+)
NetR23_1: R23.1 R24.2
NetR23_2: R23.2 U8.2(-)

### Notes on the sheet
- (near R20) Opto LED current ≈ 0.5–0.7 mA
  Output CTR(typ.) ≈ 100–160 %  →  SENSE_VR_N (active LOW)
- ON = Phase Present
  OFF = Phase Missing
- PCB copper clearance must be greather than 6 mm accourding to IPC9592.
- 0.56 mA
- (near D12) 226 mW
- Nominal: 230 Vac (phase–neutral)
  Worst-case: 400 Vac (phase–phase)
  Total resistance: 720 kΩ (4 × 180 kΩ / 0.5 W – 0805)
  At 230 Vac:
  I ≈ 230 / 720k = 0.32 mA
  P_total = V² / R = 230² / 720k = 0.073 W
  P_per 180 kΩ ≈ 0.018 W (18 mW)
  At 400 Vac (worst-case):
  I ≈ 400 / 720k = 0.56 mA
  P_total = 400² / 720k = 0.222 W
  P_per 180 kΩ ≈ 0.056 W (56 mW)
  Thermal check (per resistor):
  (180 kΩ / 0805 / 0.5 W)
  → P_max = 0.056 W ≈ 11 % load
  → ΔT ≈ P × Rθ = 0.056 W × (200–250 °C/W) ≈ +11 – 14 °C
  → T_resistor ≈ 60 °C + ΔT ≈ 71 – 74 °C < 155 °C (max)
  Safe operating region confirmed
  All resistors within voltage, power, and thermal limits.
- 3V3
  Active LOW
- LOW = Phase Present
  HIGH = Phase Missing
- I_RMS = 0.32 mA @ 230 Vac   /   0.56 mA @ 400 Vac
  V_Zener ≈ 5.1 V → I_LED ≈ 0.5–0.7 mA
  P_Zener ≈ 3 mW,  P_Opto ≈ 0.8 mW
  P_total(ResNet) = 73 mW @ 230 V  /  222 mW @ 400 V
- © 2021 All rights reserved.
  This document may not, in whole or in part, be copied, photocopied, reproduced, translated or converted to any electronic or machine readable from without prior written permission of Mehmet Günce Akkoyun.
  Engineer contact : akkoyun@me.com
- Property of
- Engineer :
- Date :
- Size :
- A4
- Time :
- Project :
- Page :
- /
- Customer :
- Product ID :
- Module ID :
- Version :
- File :
- Revision :
- (in symbol Diode - SMAJ440A (TVS)) TVS

### Library data of the parts
C4 = Capacitor - 100nF [0402-6V3]: as C1 on sheet Sense 1 Signal Isolation; ComponentLink1Description: Mouser; ComponentLink1URL: https://www.mouser.com.tr/ProductDetail/AVX/04026D104KAT4A?qs=sGAEpiMZZMs0AnBnWHyRQPg4iYkCw7IMED%2F4kpqgf7w%3D; ComponentLink2Description: DataSheet; ComponentLink2URL: https://www.mouser.com.tr/datasheet/2/40/cx5r-776519.pdf; Subcategory: Capacitors
D10 = Diode - LED (0402-Red): as D1 on sheet Sense 1 Signal Isolation; ROHS: Yes; ComponentLink1Description: DataSheet; ComponentLink1URL: https://www.mouser.com.tr/datasheet/2/348/sml-p1-e-1139198.pdf; ComponentLink2Description: Mouser; ComponentLink2URL: https://www.mouser.com.tr/ProductDetail/ROHM-Semiconductor/SML-P12U2TT86R?qs=sGAEpiMZZMseGfSY3csMkRIBDsfU3UCXJTULB5gem9Ta%252Bp%252BvZ709fg%3D%3D
D11 = Diode - BZT52H-B5V1,115: Zener Diodes BZT52H-B5V1/SOD123F/SOD2; Product Type: Zener Diodes; RoHS: Yes; Manufacturer Part Number: BZT52H-B5V1,115; Case: SOD-123F-2
D12 = Diode - SMAJ440A (TVS): as D3 on sheet Sense 1 Signal Isolation; Product Type: TVS Diodes; RoHS: Yes; Manufacturer Part Number: SMAJ440A
R19 = Resistor - 4K7 [0402]: as R1 on sheet Sense 1 Signal Isolation; ComponentLink1Description: DataSheet; ComponentLink1URL: https://www.mouser.com.tr/datasheet/2/427/dcrcwe3-1762152.pdf; ComponentLink2Description: Mouser; ComponentLink2URL: https://www.mouser.com.tr/ProductDetail/Vishay-Dale/CRCW04024K70FKED?qs=sGAEpiMZZMu61qfTUdNhG7nHf%2F6MTUn3HadIdDQu24Q%3D
R20 = Resistor - 47K [0402]: as R2 on sheet Sense 1 Signal Isolation; ComponentLink1Description: DataSheet; ComponentLink1URL: https://www.mouser.com.tr/datasheet/2/427/dcrcwe3-1762152.pdf; ComponentLink2Description: Mouser; ComponentLink2URL: https://www.mouser.com.tr/ProductDetail/Vishay-Dale/CRCW040247K0FKED?qs=sGAEpiMZZMu61qfTUdNhG2DpbjADlD3GL%252B3h1elTxqU%3D
R21-R24 = Resistor - 180K [0805]: as R3 on sheet Sense 1 Signal Isolation; ComponentLink1Description: DataSheet; ComponentLink1URL: https://www.mouser.com.tr/datasheet/2/427/dcrcwe3-1762152.pdf; ComponentLink2Description: Mouser; ComponentLink2URL: https://www.mouser.com.tr/ProductDetail/Vishay-Dale/CRCW040210K0FKED?qs=sGAEpiMZZMu61qfTUdNhG2DpbjADlD3GcalbOv9utCY%3D
U7 = IC - VOM617A: as U1 on sheet Sense 1 Signal Isolation; RoHS: Yes; Product Type: Transistor Output Optocouplers; Manufacturer Part Number: VOM617A-4T
U8 = IC - MB10S: as U2 on sheet Sense 1 Signal Isolation; Case: SOIC-4

## Sheet Sense 5 Signal Isolation.SchDoc: Signal 5 Isolator
size 292 x 193 mm; SheetNumber: 7; SheetTotal: 11
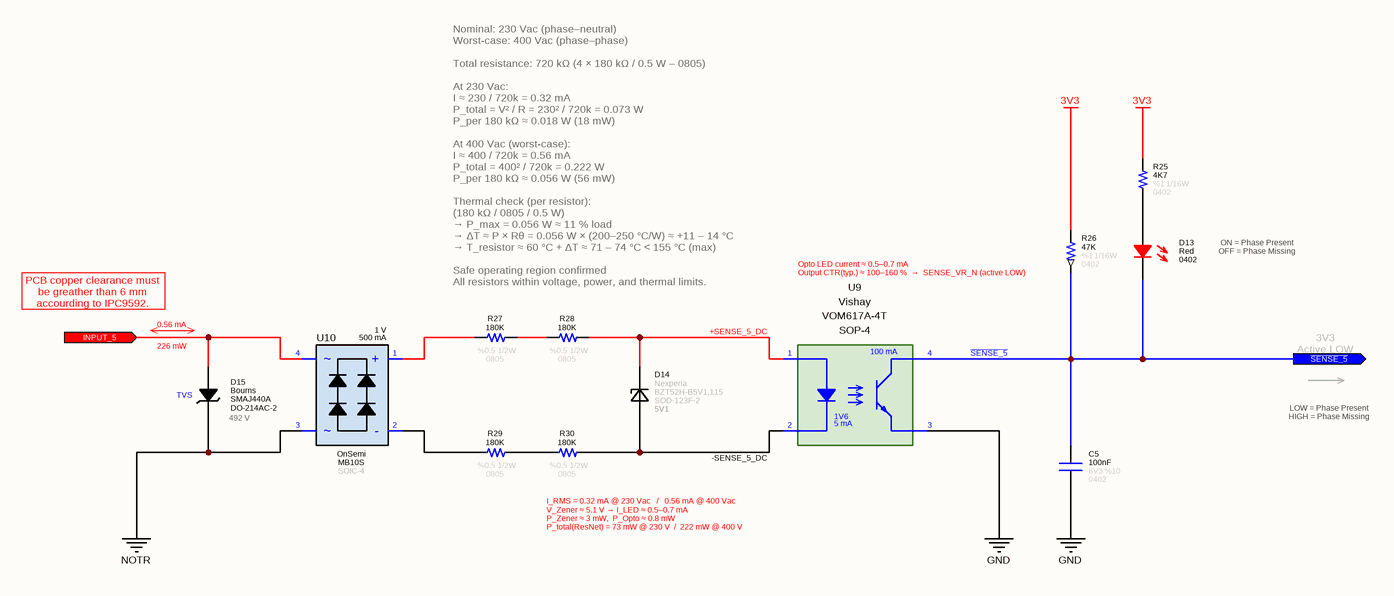
[diagram p6: Sense 5 Signal Isolation.SchDoc]

### Parts
C5  value 100nF  Tolerance: %10  Voltage: 6V3  Case: 0402  [CAPACITOR_0402]  (hidden comment: Capacitor - 100nF [0402] (MLCC))
D13  Case: 0402  Color: Red  [LED_0402]  (hidden comment: SMD LED (Red))
D14  Zener Voltage: 5V1  Manufacturer Name: Nexperia  [SOD-123F-2]  (hidden comment: BZT52H-B5V1,115)
D15  BreakDown Voltage: 492 V  Manufacturer Name: Bourns  Case: DO-214AC-2  [DO-220AA-2]  (hidden comment: SMAJ440A)
R25  value 4K7  Tolerance: %1  Case: 0402  Power: 1/16W  [RESISTOR_0402]  (hidden comment: 4K7 - 0402 - %1 - 1/16W)
R26  value 47K  Tolerance: %1  Case: 0402  Power: 1/16W  [RESISTOR_0402]  (hidden comment: 47K - 0402 - %1 - 1/16W)
R27  value 180K  Tolerance: %0.5  Case: 0805  Power: 1/2W  [RESISTOR_0805]  (hidden comment: 180K - 0805 - %0.5 - 1/2W)
R28  value 180K  Tolerance: %0.5  Case: 0805  Power: 1/2W  [RESISTOR_0805]  (hidden comment: 180K - 0805 - %0.5 - 1/2W)
R29  value 180K  Tolerance: %0.5  Case: 0805  Power: 1/2W  [RESISTOR_0805]  (hidden comment: 180K - 0805 - %0.5 - 1/2W)
R30  value 180K  Tolerance: %0.5  Case: 0805  Power: 1/2W  [RESISTOR_0805]  (hidden comment: 180K - 0805 - %0.5 - 1/2W)
U9  Manufacturer Name: Vishay  Case: SOP-4  If - Forward Current: 5 mA  Vf - Forward Voltage: 1V6  Maximum Collector Current: 100 mA  [SOP-4V2]  (hidden comment: VOM617A-4T)
U10  If - Forward Current: 500 mA  Vf - Forward Voltage: 1 V  Manufacturer Name: OnSemi  Manufacturer Part Number: MB10S  [SOIC-4]  (hidden comment: LTV-846S)

### Ports
INPUT_5 (in), ~{SENSE_5} (out)

### Nets
3V3: R25.2 R26.2
GND: C5.1 U9.3(Emiter)
NOTR: D15.2(Cathode) U10.3
+SENSE_5_DC: D14.1(Cathode) R28.1 U9.1(LED_Anode)
-SENSE_5_DC: D14.2(Anode) R30.1 U9.2(LED_Cathode)
~{SENSE_5}: C5.2 D13.1 R26.1 U9.4(Collector) ; port ~{SENSE_5}
NetD13_2: D13.2 R25.1
NetD15_1: D15.1(Anode) U10.4 ; port INPUT_5
NetR27_1: R27.1 R28.2
NetR27_2: R27.2 U10.1(+)
NetR29_1: R29.1 R30.2
NetR29_2: R29.2 U10.2(-)

### Notes on the sheet
- (near R26) Opto LED current ≈ 0.5–0.7 mA
  Output CTR(typ.) ≈ 100–160 %  →  SENSE_VR_N (active LOW)
- ON = Phase Present
  OFF = Phase Missing
- PCB copper clearance must be greather than 6 mm accourding to IPC9592.
- 0.56 mA
- (near D15) 226 mW
- Nominal: 230 Vac (phase–neutral)
  Worst-case: 400 Vac (phase–phase)
  Total resistance: 720 kΩ (4 × 180 kΩ / 0.5 W – 0805)
  At 230 Vac:
  I ≈ 230 / 720k = 0.32 mA
  P_total = V² / R = 230² / 720k = 0.073 W
  P_per 180 kΩ ≈ 0.018 W (18 mW)
  At 400 Vac (worst-case):
  I ≈ 400 / 720k = 0.56 mA
  P_total = 400² / 720k = 0.222 W
  P_per 180 kΩ ≈ 0.056 W (56 mW)
  Thermal check (per resistor):
  (180 kΩ / 0805 / 0.5 W)
  → P_max = 0.056 W ≈ 11 % load
  → ΔT ≈ P × Rθ = 0.056 W × (200–250 °C/W) ≈ +11 – 14 °C
  → T_resistor ≈ 60 °C + ΔT ≈ 71 – 74 °C < 155 °C (max)
  Safe operating region confirmed
  All resistors within voltage, power, and thermal limits.
- 3V3
  Active LOW
- LOW = Phase Present
  HIGH = Phase Missing
- I_RMS = 0.32 mA @ 230 Vac   /   0.56 mA @ 400 Vac
  V_Zener ≈ 5.1 V → I_LED ≈ 0.5–0.7 mA
  P_Zener ≈ 3 mW,  P_Opto ≈ 0.8 mW
  P_total(ResNet) = 73 mW @ 230 V  /  222 mW @ 400 V
- © 2021 All rights reserved.
  This document may not, in whole or in part, be copied, photocopied, reproduced, translated or converted to any electronic or machine readable from without prior written permission of Mehmet Günce Akkoyun.
  Engineer contact : akkoyun@me.com
- Property of
- Engineer :
- Date :
- Size :
- A4
- Time :
- Project :
- Page :
- /
- Customer :
- Product ID :
- Module ID :
- Version :
- File :
- Revision :
- (in symbol Diode - SMAJ440A (TVS)) TVS

### Library data of the parts
C5 = Capacitor - 100nF [0402-6V3]: as C1 on sheet Sense 1 Signal Isolation; ComponentLink1Description: Mouser; ComponentLink1URL: https://www.mouser.com.tr/ProductDetail/AVX/04026D104KAT4A?qs=sGAEpiMZZMs0AnBnWHyRQPg4iYkCw7IMED%2F4kpqgf7w%3D; ComponentLink2Description: DataSheet; ComponentLink2URL: https://www.mouser.com.tr/datasheet/2/40/cx5r-776519.pdf; Subcategory: Capacitors
D13 = Diode - LED (0402-Red): as D1 on sheet Sense 1 Signal Isolation; ROHS: Yes; ComponentLink1Description: DataSheet; ComponentLink1URL: https://www.mouser.com.tr/datasheet/2/348/sml-p1-e-1139198.pdf; ComponentLink2Description: Mouser; ComponentLink2URL: https://www.mouser.com.tr/ProductDetail/ROHM-Semiconductor/SML-P12U2TT86R?qs=sGAEpiMZZMseGfSY3csMkRIBDsfU3UCXJTULB5gem9Ta%252Bp%252BvZ709fg%3D%3D
D14 = Diode - BZT52H-B5V1,115: Zener Diodes BZT52H-B5V1/SOD123F/SOD2; Product Type: Zener Diodes; RoHS: Yes; Manufacturer Part Number: BZT52H-B5V1,115; Case: SOD-123F-2
D15 = Diode - SMAJ440A (TVS): as D3 on sheet Sense 1 Signal Isolation; Product Type: TVS Diodes; RoHS: Yes; Manufacturer Part Number: SMAJ440A
R25 = Resistor - 4K7 [0402]: as R1 on sheet Sense 1 Signal Isolation; ComponentLink1Description: DataSheet; ComponentLink1URL: https://www.mouser.com.tr/datasheet/2/427/dcrcwe3-1762152.pdf; ComponentLink2Description: Mouser; ComponentLink2URL: https://www.mouser.com.tr/ProductDetail/Vishay-Dale/CRCW04024K70FKED?qs=sGAEpiMZZMu61qfTUdNhG7nHf%2F6MTUn3HadIdDQu24Q%3D
R26 = Resistor - 47K [0402]: as R2 on sheet Sense 1 Signal Isolation; ComponentLink1Description: DataSheet; ComponentLink1URL: https://www.mouser.com.tr/datasheet/2/427/dcrcwe3-1762152.pdf; ComponentLink2Description: Mouser; ComponentLink2URL: https://www.mouser.com.tr/ProductDetail/Vishay-Dale/CRCW040247K0FKED?qs=sGAEpiMZZMu61qfTUdNhG2DpbjADlD3GL%252B3h1elTxqU%3D
R27-R30 = Resistor - 180K [0805]: as R3 on sheet Sense 1 Signal Isolation; ComponentLink1Description: DataSheet; ComponentLink1URL: https://www.mouser.com.tr/datasheet/2/427/dcrcwe3-1762152.pdf; ComponentLink2Description: Mouser; ComponentLink2URL: https://www.mouser.com.tr/ProductDetail/Vishay-Dale/CRCW040210K0FKED?qs=sGAEpiMZZMu61qfTUdNhG2DpbjADlD3GcalbOv9utCY%3D
U9 = IC - VOM617A: as U1 on sheet Sense 1 Signal Isolation; RoHS: Yes; Product Type: Transistor Output Optocouplers; Manufacturer Part Number: VOM617A-4T
U10 = IC - MB10S: as U2 on sheet Sense 1 Signal Isolation; Case: SOIC-4

## Sheet Sense 6 Signal Isolation.SchDoc: Signal 6 Isolator
size 292 x 193 mm; SheetNumber: 8; SheetTotal: 11
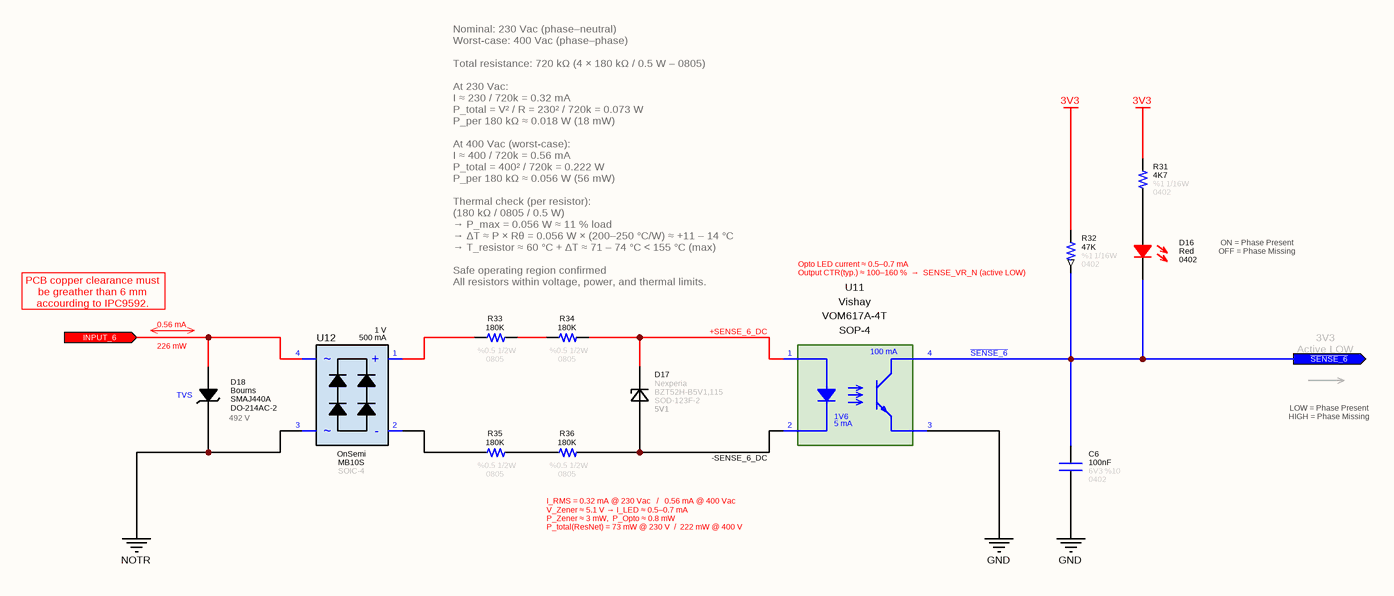
[diagram p7: Sense 6 Signal Isolation.SchDoc]

### Parts
C6  value 100nF  Tolerance: %10  Voltage: 6V3  Case: 0402  [CAPACITOR_0402]  (hidden comment: Capacitor - 100nF [0402] (MLCC))
D16  Case: 0402  Color: Red  [LED_0402]  (hidden comment: SMD LED (Red))
D17  Zener Voltage: 5V1  Manufacturer Name: Nexperia  [SOD-123F-2]  (hidden comment: BZT52H-B5V1,115)
D18  BreakDown Voltage: 492 V  Manufacturer Name: Bourns  Case: DO-214AC-2  [DO-220AA-2]  (hidden comment: SMAJ440A)
R31  value 4K7  Tolerance: %1  Case: 0402  Power: 1/16W  [RESISTOR_0402]  (hidden comment: 4K7 - 0402 - %1 - 1/16W)
R32  value 47K  Tolerance: %1  Case: 0402  Power: 1/16W  [RESISTOR_0402]  (hidden comment: 47K - 0402 - %1 - 1/16W)
R33  value 180K  Tolerance: %0.5  Case: 0805  Power: 1/2W  [RESISTOR_0805]  (hidden comment: 180K - 0805 - %0.5 - 1/2W)
R34  value 180K  Tolerance: %0.5  Case: 0805  Power: 1/2W  [RESISTOR_0805]  (hidden comment: 180K - 0805 - %0.5 - 1/2W)
R35  value 180K  Tolerance: %0.5  Case: 0805  Power: 1/2W  [RESISTOR_0805]  (hidden comment: 180K - 0805 - %0.5 - 1/2W)
R36  value 180K  Tolerance: %0.5  Case: 0805  Power: 1/2W  [RESISTOR_0805]  (hidden comment: 180K - 0805 - %0.5 - 1/2W)
U11  Manufacturer Name: Vishay  Case: SOP-4  If - Forward Current: 5 mA  Vf - Forward Voltage: 1V6  Maximum Collector Current: 100 mA  [SOP-4V2]  (hidden comment: VOM617A-4T)
U12  If - Forward Current: 500 mA  Vf - Forward Voltage: 1 V  Manufacturer Name: OnSemi  Manufacturer Part Number: MB10S  [SOIC-4]  (hidden comment: LTV-846S)

### Ports
INPUT_6 (in), ~{SENSE_6} (out)

### Nets
3V3: R31.2 R32.2
GND: C6.1 U11.3(Emiter)
NOTR: D18.2(Cathode) U12.3
+SENSE_6_DC: D17.1(Cathode) R34.1 U11.1(LED_Anode)
-SENSE_6_DC: D17.2(Anode) R36.1 U11.2(LED_Cathode)
~{SENSE_6}: C6.2 D16.1 R32.1 U11.4(Collector) ; port ~{SENSE_6}
NetD16_2: D16.2 R31.1
NetD18_1: D18.1(Anode) U12.4 ; port INPUT_6
NetR33_1: R33.1 R34.2
NetR33_2: R33.2 U12.1(+)
NetR35_1: R35.1 R36.2
NetR35_2: R35.2 U12.2(-)

### Notes on the sheet
- (near R32) Opto LED current ≈ 0.5–0.7 mA
  Output CTR(typ.) ≈ 100–160 %  →  SENSE_VR_N (active LOW)
- ON = Phase Present
  OFF = Phase Missing
- PCB copper clearance must be greather than 6 mm accourding to IPC9592.
- 0.56 mA
- (near D18) 226 mW
- Nominal: 230 Vac (phase–neutral)
  Worst-case: 400 Vac (phase–phase)
  Total resistance: 720 kΩ (4 × 180 kΩ / 0.5 W – 0805)
  At 230 Vac:
  I ≈ 230 / 720k = 0.32 mA
  P_total = V² / R = 230² / 720k = 0.073 W
  P_per 180 kΩ ≈ 0.018 W (18 mW)
  At 400 Vac (worst-case):
  I ≈ 400 / 720k = 0.56 mA
  P_total = 400² / 720k = 0.222 W
  P_per 180 kΩ ≈ 0.056 W (56 mW)
  Thermal check (per resistor):
  (180 kΩ / 0805 / 0.5 W)
  → P_max = 0.056 W ≈ 11 % load
  → ΔT ≈ P × Rθ = 0.056 W × (200–250 °C/W) ≈ +11 – 14 °C
  → T_resistor ≈ 60 °C + ΔT ≈ 71 – 74 °C < 155 °C (max)
  Safe operating region confirmed
  All resistors within voltage, power, and thermal limits.
- 3V3
  Active LOW
- LOW = Phase Present
  HIGH = Phase Missing
- I_RMS = 0.32 mA @ 230 Vac   /   0.56 mA @ 400 Vac
  V_Zener ≈ 5.1 V → I_LED ≈ 0.5–0.7 mA
  P_Zener ≈ 3 mW,  P_Opto ≈ 0.8 mW
  P_total(ResNet) = 73 mW @ 230 V  /  222 mW @ 400 V
- © 2021 All rights reserved.
  This document may not, in whole or in part, be copied, photocopied, reproduced, translated or converted to any electronic or machine readable from without prior written permission of Mehmet Günce Akkoyun.
  Engineer contact : akkoyun@me.com
- Property of
- Engineer :
- Date :
- Size :
- A4
- Time :
- Project :
- Page :
- /
- Customer :
- Product ID :
- Module ID :
- Version :
- File :
- Revision :
- (in symbol Diode - SMAJ440A (TVS)) TVS

### Library data of the parts
C6 = Capacitor - 100nF [0402-6V3]: as C1 on sheet Sense 1 Signal Isolation; ComponentLink1Description: Mouser; ComponentLink1URL: https://www.mouser.com.tr/ProductDetail/AVX/04026D104KAT4A?qs=sGAEpiMZZMs0AnBnWHyRQPg4iYkCw7IMED%2F4kpqgf7w%3D; ComponentLink2Description: DataSheet; ComponentLink2URL: https://www.mouser.com.tr/datasheet/2/40/cx5r-776519.pdf; Subcategory: Capacitors
D16 = Diode - LED (0402-Red): as D1 on sheet Sense 1 Signal Isolation; ROHS: Yes; ComponentLink1Description: DataSheet; ComponentLink1URL: https://www.mouser.com.tr/datasheet/2/348/sml-p1-e-1139198.pdf; ComponentLink2Description: Mouser; ComponentLink2URL: https://www.mouser.com.tr/ProductDetail/ROHM-Semiconductor/SML-P12U2TT86R?qs=sGAEpiMZZMseGfSY3csMkRIBDsfU3UCXJTULB5gem9Ta%252Bp%252BvZ709fg%3D%3D
D17 = Diode - BZT52H-B5V1,115: Zener Diodes BZT52H-B5V1/SOD123F/SOD2; Product Type: Zener Diodes; RoHS: Yes; Manufacturer Part Number: BZT52H-B5V1,115; Case: SOD-123F-2
D18 = Diode - SMAJ440A (TVS): as D3 on sheet Sense 1 Signal Isolation; Product Type: TVS Diodes; RoHS: Yes; Manufacturer Part Number: SMAJ440A
R31 = Resistor - 4K7 [0402]: as R1 on sheet Sense 1 Signal Isolation; ComponentLink1Description: DataSheet; ComponentLink1URL: https://www.mouser.com.tr/datasheet/2/427/dcrcwe3-1762152.pdf; ComponentLink2Description: Mouser; ComponentLink2URL: https://www.mouser.com.tr/ProductDetail/Vishay-Dale/CRCW04024K70FKED?qs=sGAEpiMZZMu61qfTUdNhG7nHf%2F6MTUn3HadIdDQu24Q%3D
R32 = Resistor - 47K [0402]: as R2 on sheet Sense 1 Signal Isolation; ComponentLink1Description: DataSheet; ComponentLink1URL: https://www.mouser.com.tr/datasheet/2/427/dcrcwe3-1762152.pdf; ComponentLink2Description: Mouser; ComponentLink2URL: https://www.mouser.com.tr/ProductDetail/Vishay-Dale/CRCW040247K0FKED?qs=sGAEpiMZZMu61qfTUdNhG2DpbjADlD3GL%252B3h1elTxqU%3D
R33-R36 = Resistor - 180K [0805]: as R3 on sheet Sense 1 Signal Isolation; ComponentLink1Description: DataSheet; ComponentLink1URL: https://www.mouser.com.tr/datasheet/2/427/dcrcwe3-1762152.pdf; ComponentLink2Description: Mouser; ComponentLink2URL: https://www.mouser.com.tr/ProductDetail/Vishay-Dale/CRCW040210K0FKED?qs=sGAEpiMZZMu61qfTUdNhG2DpbjADlD3GcalbOv9utCY%3D
U11 = IC - VOM617A: as U1 on sheet Sense 1 Signal Isolation; RoHS: Yes; Product Type: Transistor Output Optocouplers; Manufacturer Part Number: VOM617A-4T
U12 = IC - MB10S: as U2 on sheet Sense 1 Signal Isolation; Case: SOIC-4